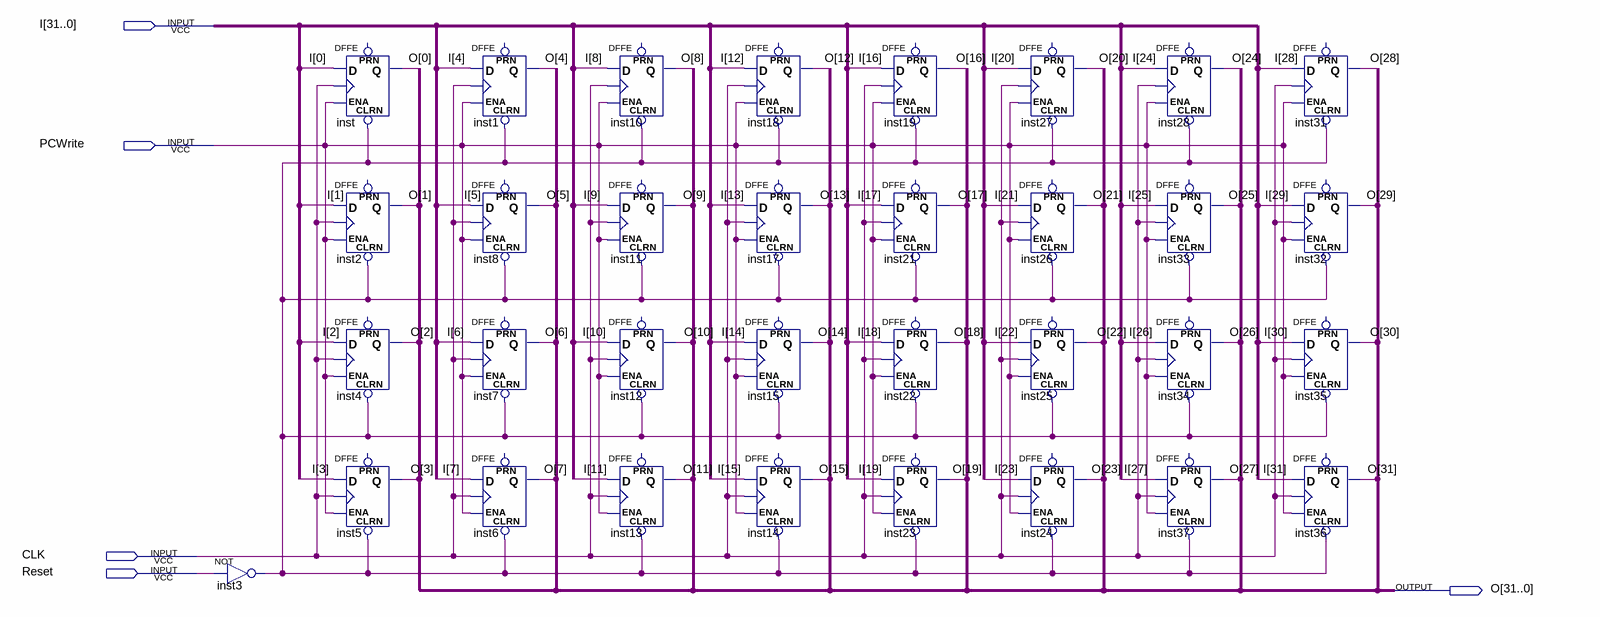
[diagram p0: schematic sheet]
// Quartus schematic PC.bdf as structural Verilog: 33 symbols, 5 pins
module PC (
  input  [31:0] I,
  input  PCWrite,
  input  CLK,
  input  Reset,
  output [31:0] O
);

  wire inst3_out;

  not inst3 (inst3_out, Reset);
  DFFE inst (.CLRN(inst3_out), .D(I[0]), .CLK(CLK), .ENA(PCWrite), .Q(O[0]));  // open: PRN
  DFFE inst2 (.CLRN(inst3_out), .D(I[1]), .CLK(CLK), .ENA(PCWrite), .Q(O[1]));  // open: PRN
  DFFE inst4 (.CLRN(inst3_out), .D(I[2]), .CLK(CLK), .ENA(PCWrite), .Q(O[2]));  // open: PRN
  DFFE inst5 (.CLRN(inst3_out), .D(I[3]), .CLK(CLK), .ENA(PCWrite), .Q(O[3]));  // open: PRN
  DFFE inst1 (.CLRN(inst3_out), .D(I[4]), .CLK(CLK), .ENA(PCWrite), .Q(O[4]));  // open: PRN
  DFFE inst8 (.CLRN(inst3_out), .D(I[5]), .CLK(CLK), .ENA(PCWrite), .Q(O[5]));  // open: PRN
  DFFE inst7 (.CLRN(inst3_out), .D(I[6]), .CLK(CLK), .ENA(PCWrite), .Q(O[6]));  // open: PRN
  DFFE inst6 (.CLRN(inst3_out), .D(I[7]), .CLK(CLK), .ENA(PCWrite), .Q(O[7]));  // open: PRN
  DFFE inst10 (.CLRN(inst3_out), .D(I[8]), .CLK(CLK), .ENA(PCWrite), .Q(O[8]));  // open: PRN
  DFFE inst11 (.CLRN(inst3_out), .D(I[9]), .CLK(CLK), .ENA(PCWrite), .Q(O[9]));  // open: PRN
  DFFE inst12 (.CLRN(inst3_out), .D(I[10]), .CLK(CLK), .ENA(PCWrite), .Q(O[10]));  // open: PRN
  DFFE inst13 (.CLRN(inst3_out), .D(I[11]), .CLK(CLK), .ENA(PCWrite), .Q(O[11]));  // open: PRN
  DFFE inst18 (.CLRN(inst3_out), .D(I[12]), .CLK(CLK), .ENA(PCWrite), .Q(O[12]));  // open: PRN
  DFFE inst17 (.CLRN(inst3_out), .D(I[13]), .CLK(CLK), .ENA(PCWrite), .Q(O[13]));  // open: PRN
  DFFE inst15 (.CLRN(inst3_out), .D(I[14]), .CLK(CLK), .ENA(PCWrite), .Q(O[14]));  // open: PRN
  DFFE inst14 (.CLRN(inst3_out), .D(I[15]), .CLK(CLK), .ENA(PCWrite), .Q(O[15]));  // open: PRN
  DFFE inst19 (.CLRN(inst3_out), .D(I[16]), .CLK(CLK), .ENA(PCWrite), .Q(O[16]));  // open: PRN
  DFFE inst21 (.CLRN(inst3_out), .D(I[17]), .CLK(CLK), .ENA(PCWrite), .Q(O[17]));  // open: PRN
  DFFE inst22 (.CLRN(inst3_out), .D(I[18]), .CLK(CLK), .ENA(PCWrite), .Q(O[18]));  // open: PRN
  DFFE inst23 (.CLRN(inst3_out), .D(I[19]), .CLK(CLK), .ENA(PCWrite), .Q(O[19]));  // open: PRN
  DFFE inst27 (.CLRN(inst3_out), .D(I[20]), .CLK(CLK), .ENA(PCWrite), .Q(O[20]));  // open: PRN
  DFFE inst26 (.CLRN(inst3_out), .D(I[21]), .CLK(CLK), .ENA(PCWrite), .Q(O[21]));  // open: PRN
  DFFE inst25 (.CLRN(inst3_out), .D(I[22]), .CLK(CLK), .ENA(PCWrite), .Q(O[22]));  // open: PRN
  DFFE inst24 (.CLRN(inst3_out), .D(I[23]), .CLK(CLK), .ENA(PCWrite), .Q(O[23]));  // open: PRN
  DFFE inst28 (.CLRN(inst3_out), .D(I[24]), .CLK(CLK), .ENA(PCWrite), .Q(O[24]));  // open: PRN
  DFFE inst33 (.CLRN(inst3_out), .D(I[25]), .CLK(CLK), .ENA(PCWrite), .Q(O[25]));  // open: PRN
  DFFE inst34 (.CLRN(inst3_out), .D(I[26]), .CLK(CLK), .ENA(PCWrite), .Q(O[26]));  // open: PRN
  DFFE inst37 (.CLRN(inst3_out), .D(I[27]), .CLK(CLK), .ENA(PCWrite), .Q(O[27]));  // open: PRN
  DFFE inst31 (.CLRN(inst3_out), .D(I[28]), .CLK(CLK), .ENA(PCWrite), .Q(O[28]));  // open: PRN
  DFFE inst32 (.CLRN(inst3_out), .D(I[29]), .CLK(CLK), .ENA(PCWrite), .Q(O[29]));  // open: PRN
  DFFE inst35 (.CLRN(inst3_out), .D(I[30]), .CLK(CLK), .ENA(PCWrite), .Q(O[30]));  // open: PRN
  DFFE inst36 (.CLRN(inst3_out), .D(I[31]), .CLK(CLK), .ENA(PCWrite), .Q(O[31]));  // open: PRN
endmodule
